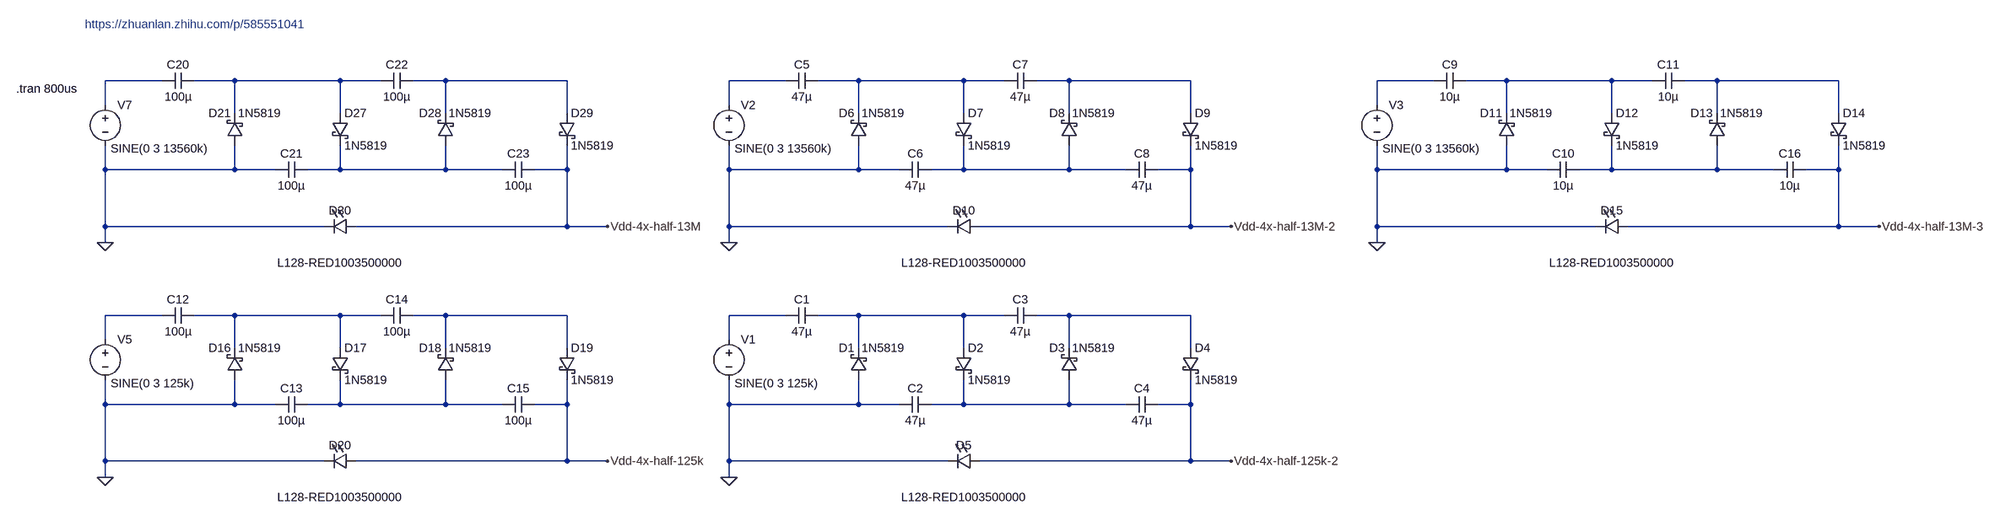
[diagram p0: schematic 13.56M.asc]
13.56M.asc, the LTspice schematic file:
Version 4
SHEET 1 3616 2472
WIRE -16 48 -128 48
WIRE 128 48 48 48
WIRE 336 48 128 48
WIRE 416 48 336 48
WIRE 544 48 480 48
WIRE 784 48 544 48
WIRE 1216 48 1104 48
WIRE 1360 48 1280 48
WIRE 1568 48 1360 48
WIRE 1648 48 1568 48
WIRE 1776 48 1712 48
WIRE 2016 48 1776 48
WIRE 2496 48 2384 48
WIRE 2640 48 2560 48
WIRE 2848 48 2640 48
WIRE 2928 48 2848 48
WIRE 3056 48 2992 48
WIRE 3296 48 3056 48
WIRE -128 96 -128 48
WIRE 1104 96 1104 48
WIRE 2384 96 2384 48
WIRE 128 112 128 48
WIRE 336 112 336 48
WIRE 544 112 544 48
WIRE 784 112 784 48
WIRE 1360 112 1360 48
WIRE 1568 112 1568 48
WIRE 1776 112 1776 48
WIRE 2016 112 2016 48
WIRE 2640 112 2640 48
WIRE 2848 112 2848 48
WIRE 3056 112 3056 48
WIRE 3296 112 3296 48
WIRE -128 224 -128 176
WIRE 128 224 128 176
WIRE 128 224 -128 224
WIRE 208 224 128 224
WIRE 336 224 336 176
WIRE 336 224 272 224
WIRE 544 224 544 176
WIRE 544 224 336 224
WIRE 656 224 544 224
WIRE 784 224 784 176
WIRE 784 224 720 224
WIRE 1104 224 1104 176
WIRE 1360 224 1360 176
WIRE 1360 224 1104 224
WIRE 1440 224 1360 224
WIRE 1568 224 1568 176
WIRE 1568 224 1504 224
WIRE 1776 224 1776 176
WIRE 1776 224 1568 224
WIRE 1888 224 1776 224
WIRE 2016 224 2016 176
WIRE 2016 224 1952 224
WIRE 2384 224 2384 176
WIRE 2640 224 2640 176
WIRE 2640 224 2384 224
WIRE 2720 224 2640 224
WIRE 2848 224 2848 176
WIRE 2848 224 2784 224
WIRE 3056 224 3056 176
WIRE 3056 224 2848 224
WIRE 3168 224 3056 224
WIRE 3296 224 3296 176
WIRE 3296 224 3232 224
WIRE -128 336 -128 224
WIRE 304 336 -128 336
WIRE 784 336 784 224
WIRE 784 336 368 336
WIRE 864 336 784 336
WIRE 1104 336 1104 224
WIRE 1536 336 1104 336
WIRE 2016 336 2016 224
WIRE 2016 336 1600 336
WIRE 2096 336 2016 336
WIRE 2384 336 2384 224
WIRE 2816 336 2384 336
WIRE 3296 336 3296 224
WIRE 3296 336 2880 336
WIRE 3376 336 3296 336
WIRE -128 368 -128 336
WIRE 1104 368 1104 336
WIRE 2384 368 2384 336
WIRE -16 512 -128 512
WIRE 128 512 48 512
WIRE 336 512 128 512
WIRE 416 512 336 512
WIRE 544 512 480 512
WIRE 784 512 544 512
WIRE 1216 512 1104 512
WIRE 1360 512 1280 512
WIRE 1568 512 1360 512
WIRE 1648 512 1568 512
WIRE 1776 512 1712 512
WIRE 2016 512 1776 512
WIRE -128 560 -128 512
WIRE 1104 560 1104 512
WIRE 128 576 128 512
WIRE 336 576 336 512
WIRE 544 576 544 512
WIRE 784 576 784 512
WIRE 1360 576 1360 512
WIRE 1568 576 1568 512
WIRE 1776 576 1776 512
WIRE 2016 576 2016 512
WIRE -128 688 -128 640
WIRE 128 688 128 640
WIRE 128 688 -128 688
WIRE 208 688 128 688
WIRE 336 688 336 640
WIRE 336 688 272 688
WIRE 544 688 544 640
WIRE 544 688 336 688
WIRE 656 688 544 688
WIRE 784 688 784 640
WIRE 784 688 720 688
WIRE 1104 688 1104 640
WIRE 1360 688 1360 640
WIRE 1360 688 1104 688
WIRE 1440 688 1360 688
WIRE 1568 688 1568 640
WIRE 1568 688 1504 688
WIRE 1776 688 1776 640
WIRE 1776 688 1568 688
WIRE 1888 688 1776 688
WIRE 2016 688 2016 640
WIRE 2016 688 1952 688
WIRE -128 800 -128 688
WIRE 304 800 -128 800
WIRE 784 800 784 688
WIRE 784 800 368 800
WIRE 864 800 784 800
WIRE 1104 800 1104 688
WIRE 1536 800 1104 800
WIRE 2016 800 2016 688
WIRE 2016 800 1600 800
WIRE 2096 800 2016 800
WIRE -128 832 -128 800
WIRE 1104 832 1104 800
FLAG -128 832 0
FLAG 864 800 Vdd-4x-half-125k
FLAG -128 368 0
FLAG 864 336 Vdd-4x-half-13M
FLAG 1104 832 0
FLAG 2096 800 Vdd-4x-half-125k-2
FLAG 1104 368 0
FLAG 2096 336 Vdd-4x-half-13M-2
FLAG 2384 368 0
FLAG 3376 336 Vdd-4x-half-13M-3
SYMBOL cap 48 496 R90
WINDOW 0 0 32 VBottom 2
WINDOW 3 32 32 VTop 2
SYMATTR InstName C12
SYMATTR Value 100µ
SYMATTR SpiceLine V=6.3 Irms=10.8 Rser=0.00432531 Lser=0
SYMBOL schottky 144 640 R180
WINDOW 0 24 64 Left 2
WINDOW 3 -75 64 Left 2
SYMATTR InstName D16
SYMATTR Value 1N5819
SYMATTR Description Diode
SYMATTR Type diode
SYMBOL schottky 320 576 R0
SYMATTR InstName D17
SYMATTR Value 1N5819
SYMATTR Description Diode
SYMATTR Type diode
SYMBOL cap 208 704 R270
WINDOW 0 32 32 VTop 2
WINDOW 3 0 32 VBottom 2
SYMATTR InstName C13
SYMATTR Value 100µ
SYMATTR SpiceLine V=6.3 Irms=10.8 Rser=0.00432531 Lser=0 mfg="KEMET" pn="C0603C106K9PAC" type="X5R"
SYMBOL voltage -128 544 R0
WINDOW 3 11 102 Left 2
WINDOW 123 0 0 Left 0
WINDOW 39 0 0 Left 0
SYMATTR Value SINE(0 3 125k)
SYMATTR InstName V5
SYMBOL cap 480 496 R90
WINDOW 0 0 32 VBottom 2
WINDOW 3 32 32 VTop 2
SYMATTR InstName C14
SYMATTR Value 100µ
SYMATTR SpiceLine V=6.3 Irms=10.8 Rser=0.00432531 Lser=0 mfg="KEMET" pn="C0603C106K9PAC" type="X5R"
SYMBOL schottky 560 640 R180
WINDOW 0 24 64 Left 2
WINDOW 3 -75 64 Left 2
SYMATTR InstName D18
SYMATTR Value 1N5819
SYMATTR Description Diode
SYMATTR Type diode
SYMBOL schottky 768 576 R0
SYMATTR InstName D19
SYMATTR Value 1N5819
SYMATTR Description Diode
SYMATTR Type diode
SYMBOL cap 656 704 R270
WINDOW 0 32 32 VTop 2
WINDOW 3 0 32 VBottom 2
SYMATTR InstName C15
SYMATTR Value 100µ
SYMATTR SpiceLine V=6.3 Irms=10.8 Rser=0.00432531 Lser=0 mfg="KEMET" pn="C0603C106K9PAC" type="X5R"
SYMBOL LED 368 784 R90
WINDOW 0 0 32 VBottom 2
WINDOW 3 72 32 VTop 2
SYMATTR InstName D20
SYMATTR Value L128-RED1003500000
SYMATTR Description Diode
SYMATTR Type diode
SYMBOL cap 48 32 R90
WINDOW 0 0 32 VBottom 2
WINDOW 3 32 32 VTop 2
SYMATTR InstName C20
SYMATTR Value 100µ
SYMATTR SpiceLine V=6.3 Irms=10.8 Rser=0.00432531 Lser=0
SYMBOL schottky 144 176 R180
WINDOW 0 24 64 Left 2
WINDOW 3 -75 64 Left 2
SYMATTR InstName D21
SYMATTR Value 1N5819
SYMATTR Description Diode
SYMATTR Type diode
SYMBOL schottky 320 112 R0
SYMATTR InstName D27
SYMATTR Value 1N5819
SYMATTR Description Diode
SYMATTR Type diode
SYMBOL cap 208 240 R270
WINDOW 0 32 32 VTop 2
WINDOW 3 0 32 VBottom 2
SYMATTR InstName C21
SYMATTR Value 100µ
SYMATTR SpiceLine V=6.3 Irms=10.8 Rser=0.00432531 Lser=0 mfg="KEMET" pn="C0603C106K9PAC" type="X5R"
SYMBOL voltage -128 80 R0
WINDOW 3 11 102 Left 2
WINDOW 123 0 0 Left 0
WINDOW 39 0 0 Left 0
SYMATTR Value SINE(0 3 13560k)
SYMATTR InstName V7
SYMBOL cap 480 32 R90
WINDOW 0 0 32 VBottom 2
WINDOW 3 32 32 VTop 2
SYMATTR InstName C22
SYMATTR Value 100µ
SYMATTR SpiceLine V=6.3 Irms=10.8 Rser=0.00432531 Lser=0 mfg="KEMET" pn="C0603C106K9PAC" type="X5R"
SYMBOL schottky 560 176 R180
WINDOW 0 24 64 Left 2
WINDOW 3 -75 64 Left 2
SYMATTR InstName D28
SYMATTR Value 1N5819
SYMATTR Description Diode
SYMATTR Type diode
SYMBOL schottky 768 112 R0
SYMATTR InstName D29
SYMATTR Value 1N5819
SYMATTR Description Diode
SYMATTR Type diode
SYMBOL cap 656 240 R270
WINDOW 0 32 32 VTop 2
WINDOW 3 0 32 VBottom 2
SYMATTR InstName C23
SYMATTR Value 100µ
SYMATTR SpiceLine V=6.3 Irms=10.8 Rser=0.00432531 Lser=0 mfg="KEMET" pn="C0603C106K9PAC" type="X5R"
SYMBOL LED 368 320 R90
WINDOW 0 0 32 VBottom 2
WINDOW 3 72 32 VTop 2
SYMATTR InstName D30
SYMATTR Value L128-RED1003500000
SYMATTR Description Diode
SYMATTR Type diode
SYMBOL cap 1280 496 R90
WINDOW 0 0 32 VBottom 2
WINDOW 3 32 32 VTop 2
SYMATTR InstName C1
SYMATTR Value 47µ
SYMATTR SpiceLine V=6.3 Irms=10.8 Rser=0.00432531 Lser=0
SYMBOL schottky 1376 640 R180
WINDOW 0 24 64 Left 2
WINDOW 3 -75 64 Left 2
SYMATTR InstName D1
SYMATTR Value 1N5819
SYMATTR Description Diode
SYMATTR Type diode
SYMBOL schottky 1552 576 R0
SYMATTR InstName D2
SYMATTR Value 1N5819
SYMATTR Description Diode
SYMATTR Type diode
SYMBOL cap 1440 704 R270
WINDOW 0 32 32 VTop 2
WINDOW 3 0 32 VBottom 2
SYMATTR InstName C2
SYMATTR Value 47µ
SYMATTR SpiceLine V=6.3 Irms=10.8 Rser=0.00432531 Lser=0 mfg="KEMET" pn="C0603C106K9PAC" type="X5R"
SYMBOL voltage 1104 544 R0
WINDOW 3 11 102 Left 2
WINDOW 123 0 0 Left 0
WINDOW 39 0 0 Left 0
SYMATTR Value SINE(0 3 125k)
SYMATTR InstName V1
SYMBOL cap 1712 496 R90
WINDOW 0 0 32 VBottom 2
WINDOW 3 32 32 VTop 2
SYMATTR InstName C3
SYMATTR Value 47µ
SYMATTR SpiceLine V=6.3 Irms=10.8 Rser=0.00432531 Lser=0 mfg="KEMET" pn="C0603C106K9PAC" type="X5R"
SYMBOL schottky 1792 640 R180
WINDOW 0 24 64 Left 2
WINDOW 3 -75 64 Left 2
SYMATTR InstName D3
SYMATTR Value 1N5819
SYMATTR Description Diode
SYMATTR Type diode
SYMBOL schottky 2000 576 R0
SYMATTR InstName D4
SYMATTR Value 1N5819
SYMATTR Description Diode
SYMATTR Type diode
SYMBOL cap 1888 704 R270
WINDOW 0 32 32 VTop 2
WINDOW 3 0 32 VBottom 2
SYMATTR InstName C4
SYMATTR Value 47µ
SYMATTR SpiceLine V=6.3 Irms=10.8 Rser=0.00432531 Lser=0 mfg="KEMET" pn="C0603C106K9PAC" type="X5R"
SYMBOL LED 1600 784 R90
WINDOW 0 0 32 VBottom 2
WINDOW 3 72 32 VTop 2
SYMATTR InstName D5
SYMATTR Value L128-RED1003500000
SYMATTR Description Diode
SYMATTR Type diode
SYMBOL cap 1280 32 R90
WINDOW 0 0 32 VBottom 2
WINDOW 3 32 32 VTop 2
SYMATTR InstName C5
SYMATTR Value 47µ
SYMATTR SpiceLine V=6.3 Irms=10.8 Rser=0.00432531 Lser=0
SYMBOL schottky 1376 176 R180
WINDOW 0 24 64 Left 2
WINDOW 3 -75 64 Left 2
SYMATTR InstName D6
SYMATTR Value 1N5819
SYMATTR Description Diode
SYMATTR Type diode
SYMBOL schottky 1552 112 R0
SYMATTR InstName D7
SYMATTR Value 1N5819
SYMATTR Description Diode
SYMATTR Type diode
SYMBOL cap 1440 240 R270
WINDOW 0 32 32 VTop 2
WINDOW 3 0 32 VBottom 2
SYMATTR InstName C6
SYMATTR Value 47µ
SYMATTR SpiceLine V=6.3 Irms=10.8 Rser=0.00432531 Lser=0 mfg="KEMET" pn="C0603C106K9PAC" type="X5R"
SYMBOL voltage 1104 80 R0
WINDOW 3 11 102 Left 2
WINDOW 123 0 0 Left 0
WINDOW 39 0 0 Left 0
SYMATTR Value SINE(0 3 13560k)
SYMATTR InstName V2
SYMBOL cap 1712 32 R90
WINDOW 0 0 32 VBottom 2
WINDOW 3 32 32 VTop 2
SYMATTR InstName C7
SYMATTR Value 47µ
SYMATTR SpiceLine V=6.3 Irms=10.8 Rser=0.00432531 Lser=0 mfg="KEMET" pn="C0603C106K9PAC" type="X5R"
SYMBOL schottky 1792 176 R180
WINDOW 0 24 64 Left 2
WINDOW 3 -75 64 Left 2
SYMATTR InstName D8
SYMATTR Value 1N5819
SYMATTR Description Diode
SYMATTR Type diode
SYMBOL schottky 2000 112 R0
SYMATTR InstName D9
SYMATTR Value 1N5819
SYMATTR Description Diode
SYMATTR Type diode
SYMBOL cap 1888 240 R270
WINDOW 0 32 32 VTop 2
WINDOW 3 0 32 VBottom 2
SYMATTR InstName C8
SYMATTR Value 47µ
SYMATTR SpiceLine V=6.3 Irms=10.8 Rser=0.00432531 Lser=0 mfg="KEMET" pn="C0603C106K9PAC" type="X5R"
SYMBOL LED 1600 320 R90
WINDOW 0 0 32 VBottom 2
WINDOW 3 72 32 VTop 2
SYMATTR InstName D10
SYMATTR Value L128-RED1003500000
SYMATTR Description Diode
SYMATTR Type diode
SYMBOL cap 2560 32 R90
WINDOW 0 0 32 VBottom 2
WINDOW 3 32 32 VTop 2
SYMATTR InstName C9
SYMATTR Value 10µ
SYMATTR SpiceLine V=6.3 Irms=10.8 Rser=0.00432531 Lser=0
SYMBOL schottky 2656 176 R180
WINDOW 0 24 64 Left 2
WINDOW 3 -75 64 Left 2
SYMATTR InstName D11
SYMATTR Value 1N5819
SYMATTR Description Diode
SYMATTR Type diode
SYMBOL schottky 2832 112 R0
SYMATTR InstName D12
SYMATTR Value 1N5819
SYMATTR Description Diode
SYMATTR Type diode
SYMBOL cap 2720 240 R270
WINDOW 0 32 32 VTop 2
WINDOW 3 0 32 VBottom 2
SYMATTR InstName C10
SYMATTR Value 10µ
SYMATTR SpiceLine V=6.3 Irms=10.8 Rser=0.00432531 Lser=0 mfg="KEMET" pn="C0603C106K9PAC" type="X5R"
SYMBOL voltage 2384 80 R0
WINDOW 3 11 102 Left 2
WINDOW 123 0 0 Left 0
WINDOW 39 0 0 Left 0
SYMATTR Value SINE(0 3 13560k)
SYMATTR InstName V3
SYMBOL cap 2992 32 R90
WINDOW 0 0 32 VBottom 2
WINDOW 3 32 32 VTop 2
SYMATTR InstName C11
SYMATTR Value 10µ
SYMATTR SpiceLine V=6.3 Irms=10.8 Rser=0.00432531 Lser=0 mfg="KEMET" pn="C0603C106K9PAC" type="X5R"
SYMBOL schottky 3072 176 R180
WINDOW 0 24 64 Left 2
WINDOW 3 -75 64 Left 2
SYMATTR InstName D13
SYMATTR Value 1N5819
SYMATTR Description Diode
SYMATTR Type diode
SYMBOL schottky 3280 112 R0
SYMATTR InstName D14
SYMATTR Value 1N5819
SYMATTR Description Diode
SYMATTR Type diode
SYMBOL cap 3168 240 R270
WINDOW 0 32 32 VTop 2
WINDOW 3 0 32 VBottom 2
SYMATTR InstName C16
SYMATTR Value 10µ
SYMATTR SpiceLine V=6.3 Irms=10.8 Rser=0.00432531 Lser=0 mfg="KEMET" pn="C0603C106K9PAC" type="X5R"
SYMBOL LED 2880 320 R90
WINDOW 0 0 32 VBottom 2
WINDOW 3 72 32 VTop 2
SYMATTR InstName D15
SYMATTR Value L128-RED1003500000
SYMATTR Description Diode
SYMATTR Type diode
TEXT -304 64 Left 2 !.tran 800us
TEXT -168 -64 Left 2 ;https://zhuanlan.zhihu.com/p/585551041

The netlist it stands for:
* 13.56M.asc
C12 N014 N013 100µ V=6.3 Irms=10.8 Rser=0.00432531 Lser=0
D16 0 N014 1N5819
D17 N014 N019 1N5819
C13 0 N019 100µ V=6.3 Irms=10.8 Rser=0.00432531 Lser=0 mfg="KEMET" pn="C0603C106K9PAC" type="X5R"
V5 N013 0 SINE(0 3 125k)
C14 N015 N014 100µ V=6.3 Irms=10.8 Rser=0.00432531 Lser=0 mfg="KEMET" pn="C0603C106K9PAC" type="X5R"
D18 N019 N015 1N5819
D19 N015 Vdd-4x-half-125k 1N5819
C15 N019 Vdd-4x-half-125k 100µ V=6.3 Irms=10.8 Rser=0.00432531 Lser=0 mfg="KEMET" pn="C0603C106K9PAC" type="X5R"
D20 Vdd-4x-half-125k 0 L128-RED1003500000
C20 N002 N001 100µ V=6.3 Irms=10.8 Rser=0.00432531 Lser=0
D21 0 N002 1N5819
D27 N002 N010 1N5819
C21 0 N010 100µ V=6.3 Irms=10.8 Rser=0.00432531 Lser=0 mfg="KEMET" pn="C0603C106K9PAC" type="X5R"
V7 N001 0 SINE(0 3 13560k)
C22 N003 N002 100µ V=6.3 Irms=10.8 Rser=0.00432531 Lser=0 mfg="KEMET" pn="C0603C106K9PAC" type="X5R"
D28 N010 N003 1N5819
D29 N003 Vdd-4x-half-13M 1N5819
C23 N010 Vdd-4x-half-13M 100µ V=6.3 Irms=10.8 Rser=0.00432531 Lser=0 mfg="KEMET" pn="C0603C106K9PAC" type="X5R"
D30 Vdd-4x-half-13M 0 L128-RED1003500000
C1 N017 N016 47µ V=6.3 Irms=10.8 Rser=0.00432531 Lser=0
D1 0 N017 1N5819
D2 N017 N020 1N5819
C2 0 N020 47µ V=6.3 Irms=10.8 Rser=0.00432531 Lser=0 mfg="KEMET" pn="C0603C106K9PAC" type="X5R"
V1 N016 0 SINE(0 3 125k)
C3 N018 N017 47µ V=6.3 Irms=10.8 Rser=0.00432531 Lser=0 mfg="KEMET" pn="C0603C106K9PAC" type="X5R"
D3 N020 N018 1N5819
D4 N018 Vdd-4x-half-125k-2 1N5819
C4 N020 Vdd-4x-half-125k-2 47µ V=6.3 Irms=10.8 Rser=0.00432531 Lser=0 mfg="KEMET" pn="C0603C106K9PAC" type="X5R"
D5 Vdd-4x-half-125k-2 0 L128-RED1003500000
C5 N005 N004 47µ V=6.3 Irms=10.8 Rser=0.00432531 Lser=0
D6 0 N005 1N5819
D7 N005 N011 1N5819
C6 0 N011 47µ V=6.3 Irms=10.8 Rser=0.00432531 Lser=0 mfg="KEMET" pn="C0603C106K9PAC" type="X5R"
V2 N004 0 SINE(0 3 13560k)
C7 N006 N005 47µ V=6.3 Irms=10.8 Rser=0.00432531 Lser=0 mfg="KEMET" pn="C0603C106K9PAC" type="X5R"
D8 N011 N006 1N5819
D9 N006 Vdd-4x-half-13M-2 1N5819
C8 N011 Vdd-4x-half-13M-2 47µ V=6.3 Irms=10.8 Rser=0.00432531 Lser=0 mfg="KEMET" pn="C0603C106K9PAC" type="X5R"
D10 Vdd-4x-half-13M-2 0 L128-RED1003500000
C9 N008 N007 10µ V=6.3 Irms=10.8 Rser=0.00432531 Lser=0
D11 0 N008 1N5819
D12 N008 N012 1N5819
C10 0 N012 10µ V=6.3 Irms=10.8 Rser=0.00432531 Lser=0 mfg="KEMET" pn="C0603C106K9PAC" type="X5R"
V3 N007 0 SINE(0 3 13560k)
C11 N009 N008 10µ V=6.3 Irms=10.8 Rser=0.00432531 Lser=0 mfg="KEMET" pn="C0603C106K9PAC" type="X5R"
D13 N012 N009 1N5819
D14 N009 Vdd-4x-half-13M-3 1N5819
C16 N012 Vdd-4x-half-13M-3 10µ V=6.3 Irms=10.8 Rser=0.00432531 Lser=0 mfg="KEMET" pn="C0603C106K9PAC" type="X5R"
D15 Vdd-4x-half-13M-3 0 L128-RED1003500000
.model D D
.lib standard.dio
.tran 800us
* https://zhuanlan.zhihu.com/p/585551041
.backanno
.end